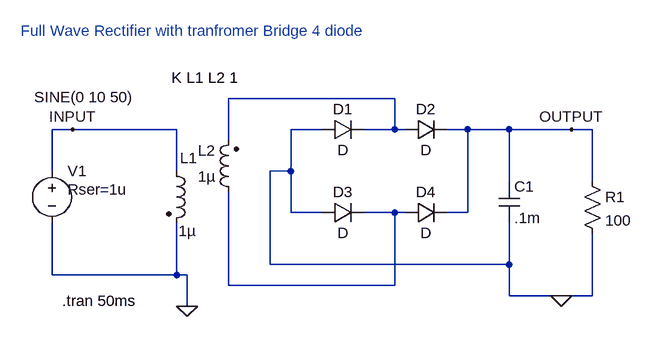
[diagram p0: schematic Full Wave Rectifier with tranfromer Bridge 4 diode .asc]
Full Wave Rectifier with tranfromer Bridge 4 diode .asc, the LTspice schematic file:
Version 4
SHEET 1 900 680
WIRE 528 0 272 0
WIRE 32 48 0 48
WIRE 192 48 32 48
WIRE 416 48 368 48
WIRE 528 48 528 0
WIRE 528 48 480 48
WIRE 544 48 528 48
WIRE 640 48 608 48
WIRE 704 48 640 48
WIRE 800 48 704 48
WIRE 832 48 800 48
WIRE 272 64 272 0
WIRE 0 112 0 48
WIRE 192 112 192 48
WIRE 368 112 368 48
WIRE 368 112 336 112
WIRE 704 128 704 48
WIRE 832 128 832 48
WIRE 368 176 368 112
WIRE 416 176 368 176
WIRE 528 176 480 176
WIRE 544 176 528 176
WIRE 640 176 640 48
WIRE 640 176 608 176
WIRE 336 256 336 112
WIRE 704 256 704 192
WIRE 704 256 336 256
WIRE 0 272 0 192
WIRE 192 272 192 192
WIRE 192 272 0 272
WIRE 208 272 192 272
WIRE 272 288 272 144
WIRE 528 288 528 176
WIRE 528 288 272 288
WIRE 704 304 704 256
WIRE 784 304 704 304
WIRE 832 304 832 208
WIRE 832 304 784 304
WIRE 208 320 208 272
FLAG 208 320 0
FLAG 32 48 INPUT
FLAG 800 48 OUTPUT
FLAG 784 304 0
SYMBOL res 816 112 R0
SYMATTR InstName R1
SYMATTR Value 100
SYMBOL ind2 176 96 R0
WINDOW 0 21 -4 Left 2
WINDOW 3 19 108 Left 2
SYMATTR InstName L1
SYMATTR Value 1µ
SYMATTR Type ind
SYMBOL ind2 288 160 R180
WINDOW 0 36 80 Left 2
WINDOW 3 36 40 Left 2
SYMATTR InstName L2
SYMATTR Value 1µ
SYMATTR Type ind
SYMBOL voltage 0 96 R0
WINDOW 3 -27 -98 Left 2
WINDOW 123 0 0 Left 0
WINDOW 39 24 44 Left 2
SYMATTR Value SINE(0 10 50)
SYMATTR SpiceLine Rser=1u
SYMATTR InstName V1
SYMBOL diode 416 64 R270
WINDOW 0 32 32 VTop 2
WINDOW 3 0 32 VBottom 2
SYMATTR InstName D1
SYMBOL diode 544 64 R270
WINDOW 0 32 32 VTop 2
WINDOW 3 0 32 VBottom 2
SYMATTR InstName D2
SYMBOL diode 416 192 R270
WINDOW 0 32 32 VTop 2
WINDOW 3 0 32 VBottom 2
SYMATTR InstName D3
SYMBOL diode 544 192 R270
WINDOW 0 32 32 VTop 2
WINDOW 3 0 32 VBottom 2
SYMATTR InstName D4
SYMBOL cap 688 128 R0
SYMATTR InstName C1
SYMATTR Value .1m
TEXT 184 -32 Left 2 !K L1 L2 1
TEXT 16 312 Left 2 !.tran 50ms
TEXT -48 -104 Left 2 ;Full Wave Rectifier with tranfromer Bridge 4 diode

The netlist it stands for:
* Full Wave Rectifier with tranfromer Bridge 4 diode .asc
R1 OUTPUT 0 100
L1 INPUT 0 1µ
L2 N002 N001 1µ
V1 INPUT 0 SINE(0 10 50) Rser=1u
D1 0 N001 D
D2 N001 OUTPUT D
D3 0 N002 D
D4 N002 OUTPUT D
C1 OUTPUT 0 .1m
.model D D
.lib standard.dio
K L1 L2 1
.tran 50ms
* Full Wave Rectifier with tranfromer Bridge 4 diode
.backanno
.end

* Results of the author's LTspice run, read from the files saved beside the schematic
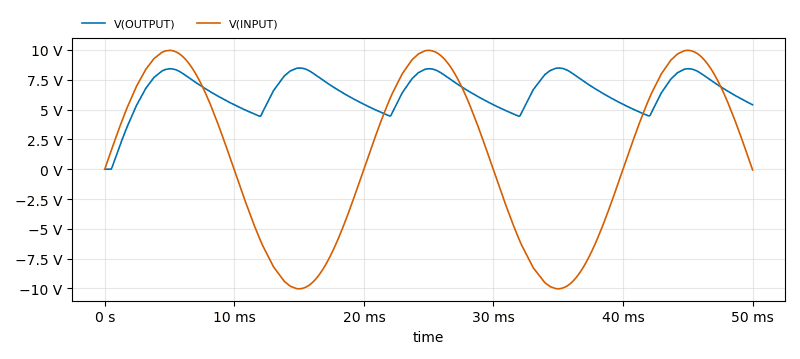
[diagram p1: Transient Analysis of Full Wave Rectifier with tranfromer Bridge 4 diode .asc, plotted from the saved traces]
* Transient Analysis, 1 run:
*   V(OUTPUT): min 0 V, max 8.489 V, average 6.444 V, rms 6.645 V, last 5.403 V
*   V(INPUT): min -10.03 V, max 9.968 V, average 1.241 V, rms 7.063 V, last -62.11 mV